# EAGLE design RAMA_M10-A_R1 (EAGLE 7.3.0)
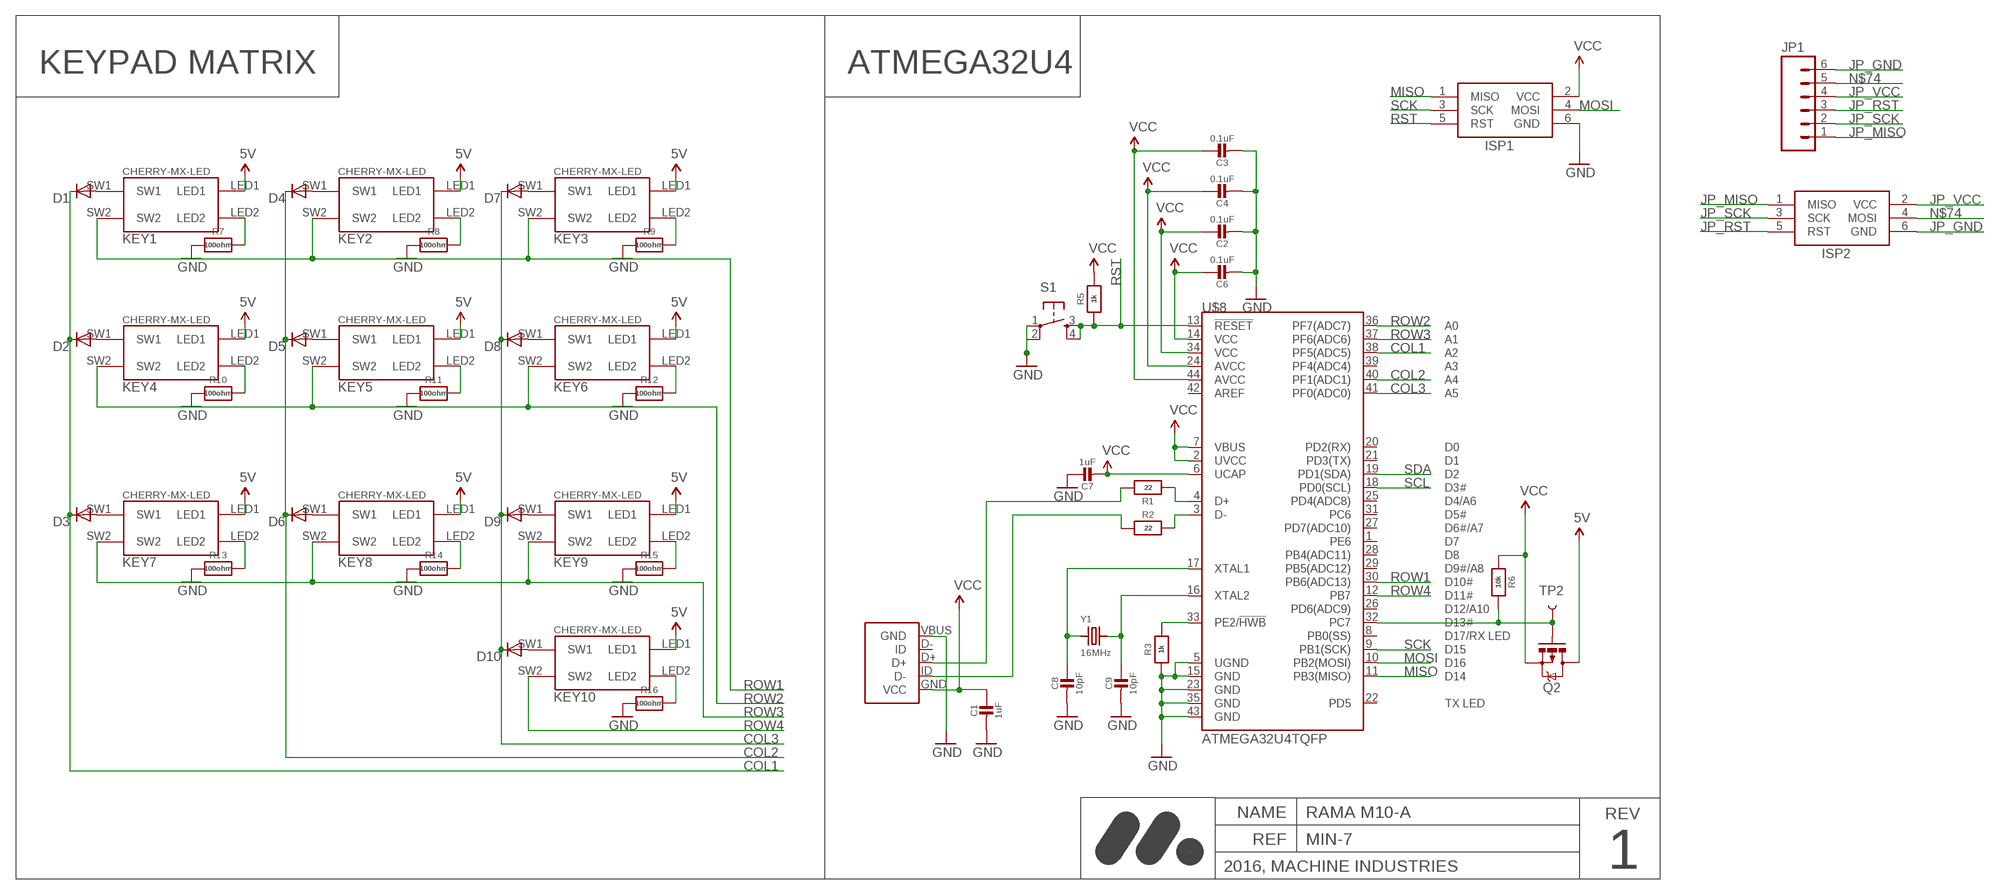
[diagram p0: schematic, sheet 1]

## Parts
C1  1uF  CAP_CERAMIC_0603MP  [_0603MP]
C2  0.1uF  CAP_CERAMIC_0603MP  [_0603MP]
C3  0.1uF  CAP_CERAMIC_0603MP  [_0603MP]
C4  0.1uF  CAP_CERAMIC_0603MP  [_0603MP]
C6  0.1uF  CAP_CERAMIC_0603MP  [_0603MP]
C7  1uF  CAP_CERAMIC_0603MP  [_0603MP]
C8  10pF  CAP_CERAMIC_0603MP  [_0603MP]
C9  10pF  CAP_CERAMIC_0603MP  [_0603MP]
D1  DIODESOD  [SOD-323]
D2  DIODESOD  [SOD-323]
D3  DIODESOD  [SOD-323]
D4  DIODESOD  [SOD-323]
D5  DIODESOD  [SOD-323]
D6  DIODESOD  [SOD-323]
D7  DIODESOD  [SOD-323]
D8  DIODESOD  [SOD-323]
D9  DIODESOD  [SOD-323]
D10  DIODESOD  [SOD-323]
ISP1  AVRISP-SMT  [AVRISP-SMT]
ISP2  AVRISP-SMT  [AVRISP-SMT]
JP1  M06SIP  [1X06]
KEY1  CHERRY-MX-LED-18X18  [CHERRY-MX-LED-18X18]
KEY2  CHERRY-MX-LED-18X18  [CHERRY-MX-LED-18X18]
KEY3  CHERRY-MX-LED-18X18  [CHERRY-MX-LED-18X18]
KEY4  CHERRY-MX-LED-18X18  [CHERRY-MX-LED-18X18]
KEY5  CHERRY-MX-LED-18X18  [CHERRY-MX-LED-18X18]
KEY6  CHERRY-MX-LED-18X18  [CHERRY-MX-LED-18X18]
KEY7  CHERRY-MX-LED-18X18  [CHERRY-MX-LED-18X18]
KEY8  CHERRY-MX-LED-18X18  [CHERRY-MX-LED-18X18]
KEY9  CHERRY-MX-LED-18X18  [CHERRY-MX-LED-18X18]
KEY10  CHERRY-MX-LED-18X18  [CHERRY-MX-LED-18X18]
Q2  PCHANNEL-MOSFET  MOSFET-PCHANNELSMD  [SOT23-3]
R1  22  RESISTOR_0603MP  [_0603MP]
R2  22  RESISTOR_0603MP  [_0603MP]
R3  1k  RESISTOR_0603MP  [_0603MP]
R5  1k  RESISTOR_0603MP  [_0603MP]
R6  10k  RESISTOR_0603MP  [_0603MP]
R7  100ohm  RESISTOR_0603MP  [_0603MP]
R8  100ohm  RESISTOR_0603MP  [_0603MP]
R9  100ohm  RESISTOR_0603MP  [_0603MP]
R10  100ohm  RESISTOR_0603MP  [_0603MP]
R11  100ohm  RESISTOR_0603MP  [_0603MP]
R12  100ohm  RESISTOR_0603MP  [_0603MP]
R13  100ohm  RESISTOR_0603MP  [_0603MP]
R14  100ohm  RESISTOR_0603MP  [_0603MP]
R15  100ohm  RESISTOR_0603MP  [_0603MP]
R16  100ohm  RESISTOR_0603MP  [_0603MP]
S1  TAC_SWITCHSMD  [TACTILE_SWITCH_SMD]
TP2  TEST-POINT3  [PAD.03X.03]
U$8  ATMEGA32U4TQFP  [SPARKFUN-DIGITALIC_TQFP44]
U$9  MICRO-USB-B-FEMALE  [10118192-0001LF]
Y1  16MHz  CRYSTAL3.2X2.5  [CRYSTAL_3.2X2.5]

## Nets
5V: KEY1.LED1 KEY2.LED1 KEY3.LED1 KEY4.LED1 KEY5.LED1 KEY6.LED1 KEY7.LED1 KEY8.LED1 KEY9.LED1 KEY10.LED1 Q2.3(D)
COL1: D1.1(C) D2.1(C) D3.1(C) U$8.38(PF5(ADC5))
COL2: D4.1(C) D5.1(C) D6.1(C) U$8.40(PF1(ADC1))
COL3: D7.1(C) D8.1(C) D9.1(C) D10.1(C) U$8.41(PF0(ADC0))
GND: C1.2 C2.2 C3.2 C4.2 C6.2 C7.1 C8.2 C9.2 ISP1.6(GND) R3.1 R7.1 R8.1 R9.1 R10.1 R11.1 R12.1 R13.1 R14.1 R15.1 R16.1 S1.1 S1.2 U$8.5(UGND) U$8.15(GND) U$8.23(GND) U$8.35(GND) U$8.43(GND) U$9.VBUS(GND)
JP_GND: ISP2.6(GND) JP1.6
JP_MISO: ISP2.1(MISO) JP1.1
JP_RST: ISP2.5(RST) JP1.3
JP_SCK: ISP2.3(SCK) JP1.2
JP_VCC: ISP2.2(VCC) JP1.4
MISO: ISP1.1(MISO) U$8.11(PB3(MISO))
MOSI: ISP1.4(MOSI) U$8.10(PB2(MOSI))
N$6: R1.1 U$9.D+
N$7: R2.1 U$9.ID(D-)
N$8: R2.2 U$8.3(D-)
N$9: R1.2 U$8.4(D+)
N$10: C8.1 U$8.17(XTAL1) Y1.1
N$11: C9.1 U$8.16(XTAL2) Y1.2
N$12: R3.2 U$8.33(PE2/!HWB)
N$13: Q2.1(G) R6.2 TP2.P$1 U$8.32(PC7)
N$16: D1.2(A) KEY1.SW1
N$17: D2.2(A) KEY4.SW1
N$18: D3.2(A) KEY7.SW1
N$19: D4.2(A) KEY2.SW1
N$20: D5.2(A) KEY5.SW1
N$21: D6.2(A) KEY8.SW1
N$22: D9.2(A) KEY9.SW1
N$23: D8.2(A) KEY6.SW1
N$24: D7.2(A) KEY3.SW1
N$25: D10.2(A) KEY10.SW1
N$28: KEY7.LED2 R13.2
N$29: KEY8.LED2 R14.2
N$30: KEY9.LED2 R15.2
N$31: KEY10.LED2 R16.2
N$32: KEY4.LED2 R10.2
N$69: KEY5.LED2 R11.2
N$70: KEY6.LED2 R12.2
N$71: KEY3.LED2 R9.2
N$72: KEY2.LED2 R8.2
N$73: KEY1.LED2 R7.2
N$74: ISP2.4(MOSI) JP1.5
ROW1: KEY1.SW2 KEY2.SW2 KEY3.SW2 U$8.30(PB6(ADC13))
ROW2: KEY4.SW2 KEY5.SW2 KEY6.SW2 U$8.36(PF7(ADC7))
ROW3: KEY7.SW2 KEY8.SW2 KEY9.SW2 U$8.37(PF6(ADC6))
ROW4: KEY10.SW2 U$8.12(PB7)
RST: ISP1.5(RST) R5.1 S1.3 S1.4 U$8.13(!RESET)
SCK: ISP1.3(SCK) U$8.9(PB1(SCK))
SCL: U$8.18(PD0(SCL))
SDA: U$8.19(PD1(SDA))
VCC: C1.1 C2.1 C3.1 C4.1 C6.1 C7.2 ISP1.2(VCC) Q2.2(S) R5.2 R6.1 U$8.2(UVCC) U$8.6(UCAP) U$8.7(VBUS) U$8.14(VCC) U$8.24(AVCC) U$8.34(VCC) U$8.44(AVCC) U$9.GND(VCC)
Unconnected: U$8.1(PE6) U$8.8(PB0(SS)) U$8.20(PD2(RX)) U$8.21(PD3(TX)) U$8.22(PD5) U$8.25(PD4(ADC8)) U$8.26(PD6(ADC9)) U$8.27(PD7(ADC10)) U$8.28(PB4(ADC11)) U$8.29(PB5(ADC12)) U$8.31(PC6) U$8.39(PF4(ADC4)) U$8.42(AREF) U$9.D-(ID)

## Notes on the sheet
- KEYPAD MATRIX | ATMEGA32U4
- NAME | RAMA M10-A | REV
- REF | MIN-7
- 2016, MACHINE INDUSTRIES | 1

## Library data of the parts
C1-C4 C6-C9 = Adafruit Bluefruit LE nRF8001:CAP_CERAMIC: Ceramic Capacitors For new designs, use the packages preceded by an '_' character since they are more reliable: The following footprints should be used on most boards: _0402 - Standard footprint for regular board layouts _0603 - Standard footprint for regular board layouts _0805 - Standard footprint for regular board layouts _1206 - Standard footprint for regular board layouts For extremely tight-pitch boards where space is at a premium, the following 'micro-pitch' footprints can be used (smaller pads, no silkscreen outline, etc.): _0402MP - Micro-pitch footprint for very dense/compact boards _0603MP - Micro-pitch footprint for very dense/compact boards _0805MP - Micro-pitch footprint for very dense/compact boards _1206MP - Micro-pitch footprint for very dense/compact boards
D1-D10 = SparkFun-DiscreteSemi:DIODE: Diode These are standard reverse protection diodes and small signal diodes. SMA package can handle up to about 1A. SOD-323 can handle about 200mA. What the SOD-323 package when ordering, there are some mfgs out there that are 5-pin packages.; PROD_ID: DIO-09646
ISP1 ISP2 = adafruit:AVRISP: AVR ISP HEADER Standard 6 pin header for AVR programming
JP1 = SparkFun-Connectors:M06: Header 6 Standard 6-pin 0.1" header. Use with straight break away headers (SKU : PRT-00116), right angle break away headers (PRT-00553), swiss pins (PRT-00743), machine pins (PRT-00117), and female headers (PRT-00115). Molex polarized connector foot print use with SKU : PRT-08094 with associated crimp pins and housings. NOTES ON THE VARIANTS LOCK and LOCK_LONGPADS... This footprint was designed to help hold the alignment of a through-hole component (i.e. 6-pin header) while soldering it into place. You may notice that each hole has been shifted either up or down by 0.005 of an inch from it's more standard position (which is a perfectly straight line). This slight alteration caused the pins (the squares in the middle) to touch the edges of the holes. Because they are alternating, it causes a "brace" to hold the component in place. 0.005 has proven to be the perfect amount of "off-center" position when using our standard breakaway headers. Although looks a little odd when you look at the bare footprint, once you have a header in there, the alteration is very hard to notice. Also,if you push a header all the way into place, it is covered up entirely on the bottom side. This idea of altering the position of holes to aid alignment will be further integrated into the Sparkfun Library for other footprints. It can help hold any component with 3 or more connection pins.
KEY1-KEY10 = cherrymx:CHERRY-MX-LED: Cherry MX series keyswitch with LED
Q2 = SparkFun-DiscreteSemi:MOSFET-PCHANNEL: Generic PMOSFET
R1-R3 R5-R16 = Adafruit Bluefruit LE nRF8001:RESISTOR: Resistors For new designs, use the packages preceded by an '_' character since they are more reliable: The following footprints should be used on most boards: _0402 - Standard footprint for regular board layouts _0603 - Standard footprint for regular board layouts _0805 - Standard footprint for regular board layouts _1206 - Standard footprint for regular board layouts For extremely tight-pitch boards where space is at a premium, the following 'micro-pitch' footprints can be used (smaller pads, no silkscreen outline, etc.): _0402MP - Micro-pitch footprint for very dense/compact boards _0603MP - Micro-pitch footprint for very dense/compact boards _0805MP - Micro-pitch footprint for very dense/compact boards _1206MP - Micro-pitch footprint for very dense/compact boards
S1 = SparkFun-Electromechanical:TAC_SWITCH: Momentary Switch Button commonly used for reset or general input. Spark Fun Electronics SKU : COM-00097 SMT- SWCH-08247; PROD_ID: SWCH-08247
TP2 = SparkFun-Passives:TEST-POINT: Bare copper test points for troubleshooting or ICT
U$8 = SparkFun-DigitalIC:ATMEGA32U4: Atmel 44-pin 8-bit Microcontroller with 32KBytes of ISP Flash and USB Controller ----- Please use the QFN-44-NOPAD_1:1 package for the footprint of all boards using a 32U4. Route traces directly away from the pads as much as possible.; PROD_ID: IC-11161
U$9 = Bolt:MICRO-USB-B-FEMALE
Y1 = Adafruit Bluefruit LE nRF8001:CRYSTAL: Crystals HC49UP - Surface Mount Crystal 4.0MHz 18pF +/-30ppm Surface Mount Crystal [Digikey: 535-9857-1-ND] 12.0 MHz Surface Mount Crystal [Digikey: 535-9869-6-ND] 25.0 MHz Surface Mount Crystal [Digikey: 535-9078-1-ND] 2.5 x 2.0mm - MEMs SMT Crystal 16.0 MHz 10pF 20ppm 2.5 x 2.0mm Crystal [Digikey -40-85°C: 535-10923-1-ND] 3.2 x 2.5mm - MEMs SMT Crystal 12.0 MHz 8pF 15ppm 3.2 x 2.5mm Crystal [Digikey: -10-70°C: 644-1047-1-ND -40-125°C: 644-1128-1-ND] 40~85°C cheaper: 644-1173-6-ND 16.0 MHz 8pF 15ppm 3.2 x 2.5mm Crystal [Digikey: -10-70°C: 644-1049-1-ND -40-125°C: 644-1129-2-ND]-40~85°C cheaper: 644-1175-6-ND 16.0 MHz 10pF 10ppm 3.2 x 2.5mm Crystal [Digikey: 644-1100-1-ND] 27.12 MHz 18pF 30ppm 3.2 x 2.5mm Crystal [Digikey: 887-1424-1-ND] 27.12MHz 10pF 10ppm 3.2 x 2.5mm Crystal [Digikey: 887-1329-1-ND] 4.9 x 1.8mm - MEMs SMT Crystal 32.768 KHz 12.5pF 20ppm 4.9 x 1.8mm Crystal [Digikey: SE2415CT-ND] 8.0 x 3.8mm - Surface Mount Crystal 32.768kHz 12.5pF 20ppm -40°C-85°C [Digikey: 535-9166-2-ND] Cylinder 32.768KHz Cylinder Crystal (2x6mm body) [Ex. Digikey: 300-8341-2-ND]

## Board
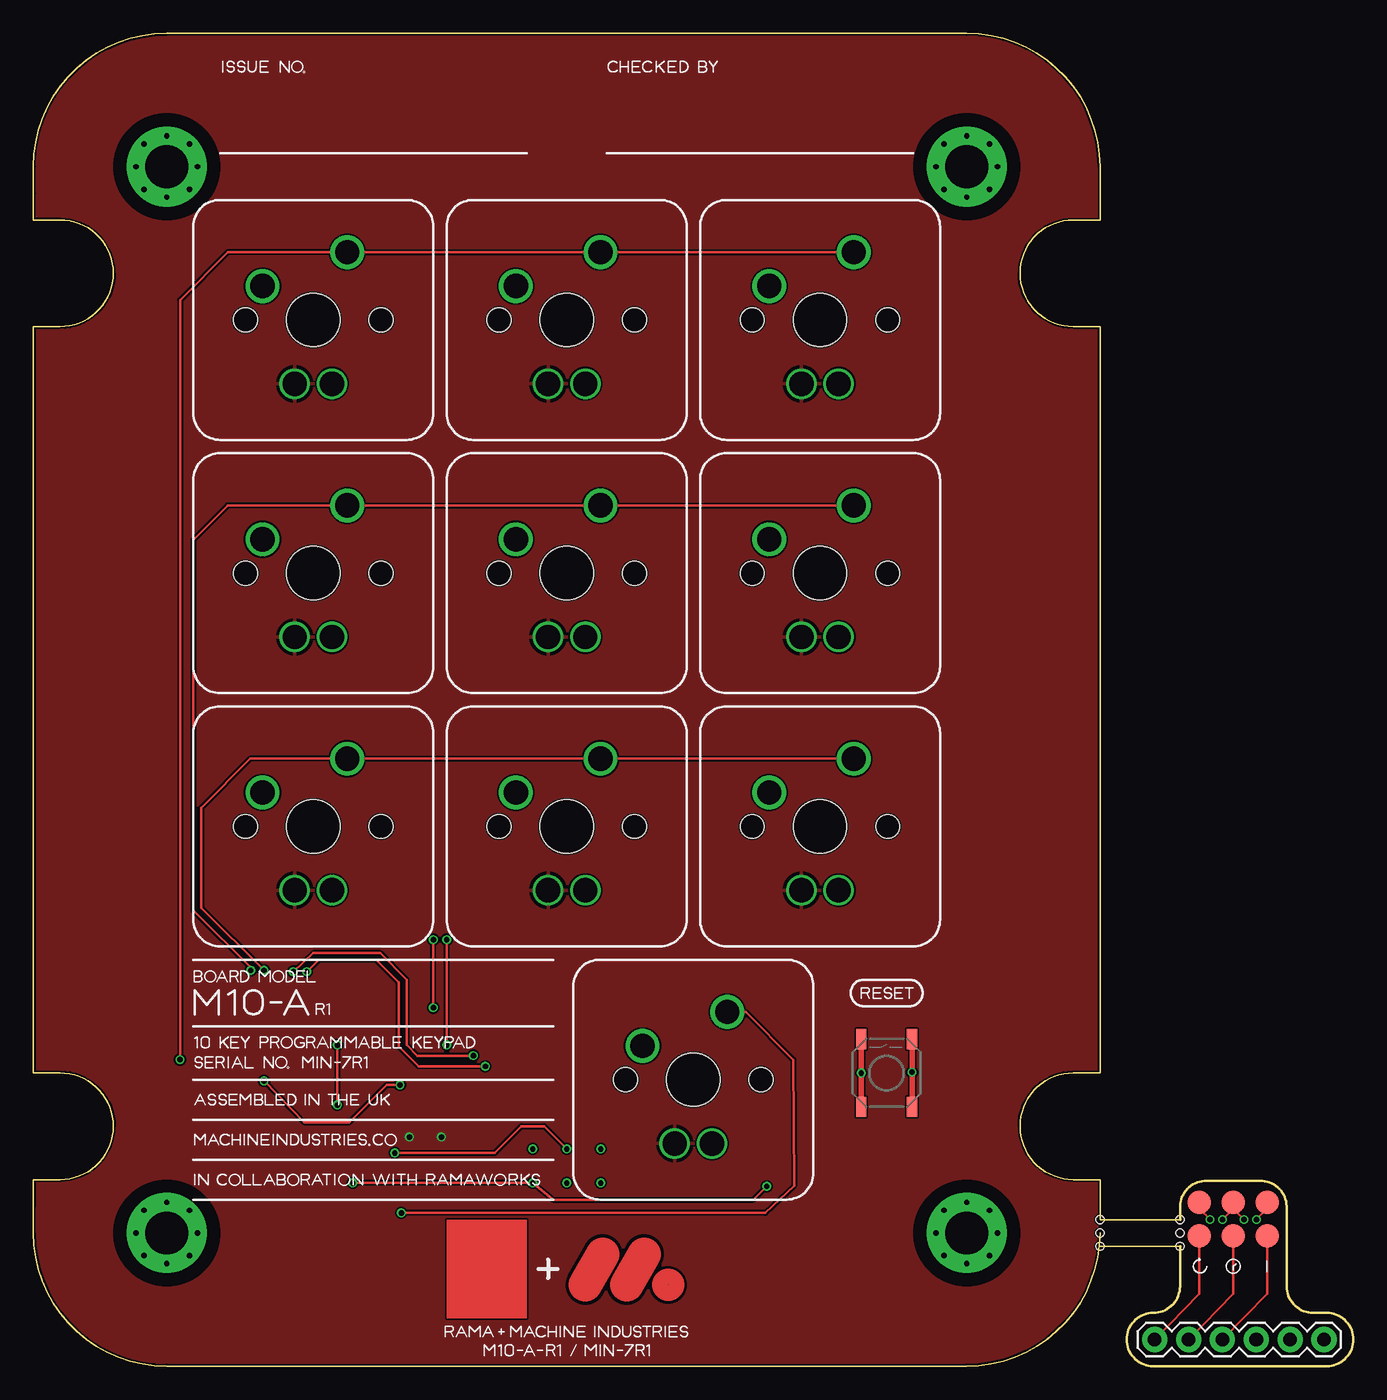
[diagram p1: board, top side]
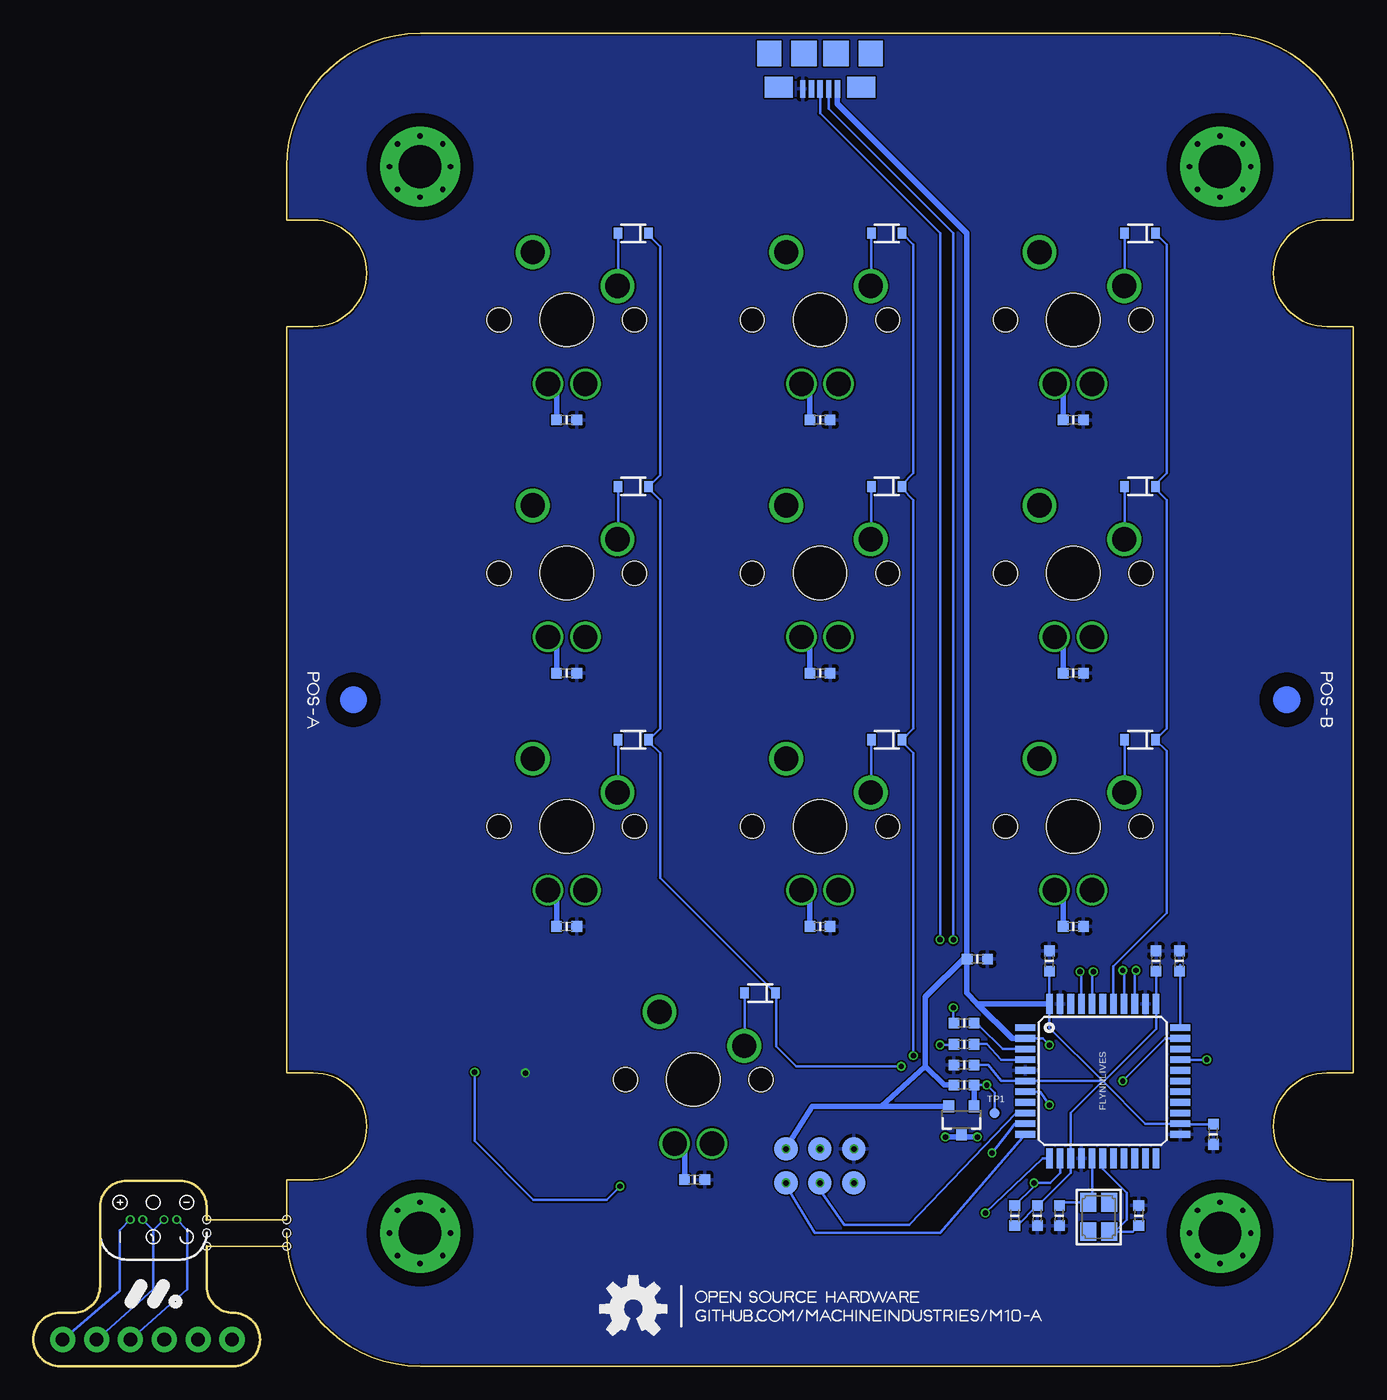
[diagram p2: board, bottom side, seen from below]

Size 99 x 100 mm. Coordinates in mm from the lower left corner, seen from the top.
Outline: 80,10 arc-90 70,0 10,0 arc-90 0,10 0,12 0,14 2,14 arc90 6,18 arc90 2,22 0,22 0,78 2,78 arc90 6,82 arc90 2,86 0,86 0,88 0,90 arc-90 10,100 70,100 arc-90 80,90 80,86 78,86 arc90 74,82 arc90 78,78 80,78 80,22 78,22 arc90 74,18 arc90 78,14 80,14 80,11 86,11 86,12 arc-90 88,13.9 92,13.9 arc-90 94,12 94,6 arc90 96,4 97,4 arc-90 99,2 arc-90 97,0 84,0 arc-90 82,2 arc-90 84,4 arc90 86,6 86,9 80,9
Copper layers (1*16): Top 0.035mm / dielectric 1.5mm / Bottom 0.035mm
Design rules "default *": minimum track width 1.25mm, minimum drill 12mil, track to track 0.125mm, track to pad 0.125mm, pad to pad 0.125mm, via to via 0.125mm, smd to smd 0mil, copper to edge 0.125mm, drill to drill 0.125mm, minimum pad ring 5mil, minimum via ring 5mil, stop-mask expansion 4mil, vias tented up to drill 0.4mm, thermal gap 10mil
Holes 0.6 mm at 86,11 86,10 86,9 80,11 80,10 80,9
tRestrict: area 8,8 to 12,12; area 46.9,5.4 to 48.3,6.8; area 31,3.6 to 37,11; area 8,88 to 12,92; area 68,88 to 72,92; area 68,8 to 72,12; 2 lines
bRestrict: area 3,48 to 7,52; area 8,8 to 12,12; area 73,48 to 77,52; area 8,88 to 12,92; area 68,88 to 72,92; area 68,8 to 72,12

### Footprints (pad centres in the part's own frame; a part is rotated, then mirrored left to right if it is on the bottom)
_0603MP = smd 0.8 x 0.8: 1 -0.762,0; 2 0.762,0
SOD-323 = smd 0.63 x 0.83: 1 -1.15,0; 2 1.15,0
AVRISP-SMT = smd 1.778 x 1.778: 1 -1.23,2.55; 2 1.31,2.55; 3 -1.23,0.01; 4 1.31,0.01; 5 -1.23,-2.53; 6 1.31,-2.53
1X06 = drill 1.016 pad 1.88: 1 0,0; 2 2.54,0; 3 5.08,0; 4 7.62,0; 5 10.16,0; 6 12.7,0
CHERRY-MX-LED-18X18 = drill 1.82 pad 2.286: LED1 -1.397,-4.791; LED2 1.397,-4.791 | drill 1.82 pad 2.54: SW1 -3.81,2.54; SW2 2.54,5.08 | hole 4: 0,0 | hole 1.8: 5.08,0; -5.08,0
SOT23-3 = smd 0.8 x 0.9: 1 -0.95,-1; 2 0.95,-1; 3 0,1.1
TACTILE_SWITCH_SMD = smd 1.524 x 0.762: 1 -2.54,1.905; 2 2.54,1.905; 3 -2.54,-1.905; 4 2.54,-1.905
PAD.03X.03 = smd 0.762 x 0.762: P$1 0,0
SPARKFUN-DIGITALIC_TQFP44 = smd 1.5 x 0.5: 1 -5.8,4; 2 -5.8,3.2; 3 -5.8,2.4; 4 -5.8,1.6; 5 -5.8,0.8; 6 -5.8,0; 7 -5.8,-0.8; 8 -5.8,-1.6; 9 -5.8,-2.4; 10 -5.8,-3.2; 11 -5.8,-4; 23 5.8,-4; 24 5.8,-3.2; 25 5.8,-2.4; 26 5.8,-1.6; 27 5.8,-0.8; 28 5.8,0; 29 5.8,0.8; 30 5.8,1.6; 31 5.8,2.4; 32 5.8,3.2; 33 5.8,4 | smd 0.5 x 1.5: 12 -4,-5.8; 13 -3.2,-5.8; 14 -2.4,-5.8; 15 -1.6,-5.8; 16 -0.8,-5.8; 17 0,-5.8; 18 0.8,-5.8; 19 1.6,-5.8; 20 2.4,-5.8; 21 3.2,-5.8; 22 4,-5.8; 34 4,5.8; 35 3.2,5.8; 36 2.4,5.8; 37 1.6,5.8; 38 0.8,5.8; 39 0,5.8; 40 -0.8,5.8; 41 -1.6,5.8; 42 -2.4,5.8; 43 -3.2,5.8; 44 -4,5.8
10118192-0001LF = smd 0.4 x 1.35: D+ 0,2.675; D- 0.65,2.675; GND -1.3,2.675; GND1 -1.3,2.675; ID -0.65,2.675; VBUS 1.3,2.675 | smd 2.1 x 1.6: P$6 -3.1,2.55; P$7 3.1,2.55 | smd 1.8 x 1.9: P$8 -3.8,0; P$9 3.8,0 | smd 1.9 x 1.9: P$10 -1.2,0; P$11 1.2,0
CRYSTAL_3.2X2.5 = smd 1.4 x 1.2: 1 -1.1,-0.8; 2 1.1,0.8; GND1 -1.1,0.8; GND2 1.1,-0.8

### Placement (x,y rotation side)
C1  28.2,30.55 0 bottom
C2  10.5,17.4 270 bottom
C3  22.8,30.4 90 bottom
C4  23.7,11.3 270 bottom
C6  14.8,30.4 90 bottom
C7  29.2,22.6 0 bottom
C8  16.1,11.3 90 bottom
C9  22.05,11.3 270 bottom
D1  16,85 180 bottom
D2  16,66 180 bottom
D3  16,47 180 bottom
D4  35,85 180 bottom
D5  35,66 180 bottom
D6  35,47 180 bottom
D7  54,85 180 bottom
D8  54,66 180 bottom
D9  54,47 180 bottom
D10  44.5,28 180 bottom
ISP1  40,15 90 bottom
ISP2  90,11 90 top
JP1  84.1,2 0 top
KEY1  21,78.5 0 top
KEY2  40,78.5 0 top
KEY3  59,78.5 0 top
KEY4  21,59.5 0 top
KEY5  40,59.5 0 top
KEY6  59,59.5 0 top
KEY7  21,40.5 0 top
KEY8  40,40.5 0 top
KEY9  59,40.5 0 top
KEY10  49.5,21.5 0 top
Q2  29.4,18.5 180 bottom
R1  29.2,24.15 0 bottom
R2  29.2,25.75 0 bottom
R3  13.05,30.4 270 bottom
R5  25.4,11.3 270 bottom
R6  29.2,21.1 0 bottom
R7  21,71 180 bottom
R8  40,71 180 bottom
R9  59,71 180 bottom
R10  21,52 180 bottom
R11  40,52 180 bottom
R12  59,52 180 bottom
R13  21,33 180 bottom
R14  40,33 180 bottom
R15  59,33 180 bottom
R16  49.4,14 180 bottom
S1  64,22 90 top
TP2  26.9,19 0 bottom
U$8  18.8,21.4 0 bottom
U$9  40,98.5 180 bottom
Y1  19.1,11.2 90 bottom

### Tracks (layer width: path | path; a pad name or v marks a point on that pad's centre or on a via)
5V  (via drill 0.4)
  Bottom 0.4: 29.3,17.4 Q2.3 29,17.2 v28.2,17.2 | v30.6,17.2 29.3,17.2
  pour Top: -1,101 81,101 81,-1 -1,-1
COL1
  Bottom 0.2: D1.1 14,84.15 14,67 14.85,66.15 D2.1 14.85,65.85 14,65 14,47.85 D3.1 14,46.15 14,34 18,30 U$8.38
COL2  (via drill 0.4)
  Top 0.2: v33,23.3 28.8,23.3 28,24.1 28,29 26,31 21,31 v19.5,29.6
  Bottom 0.2: D4.1 33,84.15 33,67 33.85,66.15 D5.1 33.85,65.85 33,65 33,47.85 D6.1 33.85,46.85 33,46 v33,23.3 | U$8.40 19.6,29.5 v19.5,29.6
COL3  (via drill 0.4)
  Top 0.2: v33.9,22.5 28.9,22.5 27.4,24 27.4,28.8 25.7,30.5 21.4,30.5 v20.5,29.6
  Bottom 0.2: D7.1 52.85,84.85 52,84 52,66.85 D8.1 52.85,65.85 52,65 52,47.85 D9.1 52.85,46.85 52,46 52,36.65 D10.1 | D10.1 43.3,28 | U$8.41 20.4,29.5 v20.5,29.6 | v33.9,22.5 41.8,22.5 43.3,24 43.3,27.95 D10.1
GND  (via drill 0.4)
  Top 0.4: S1.1 62.09,21.89 v62.1,22 S1.2
  other vias: 37.45,16.3
  pour Bottom: -2,-2 82,-2 82,102 -2,102
JP_GND  (via drill 0.4)
  Top 0.2: v91.73,11.01 92.72,12 93,12 92.69,12.31 ISP2.6
  Bottom 0.2: JP1.6 92.53,5.67 92.53,10.21 v91.73,11.01
JP_MISO
  Top 0.2: JP1.1 87.45,5.45 ISP2.1
JP_RST
  Top 0.2: JP1.3 92.53,5.45 ISP2.5
JP_SCK
  Top 0.2: JP1.2 89.99,5.45 ISP2.3
JP_VCC  (via drill 0.4)
  Top 0.2: 87.76,12 88,12 87.69,12.31 ISP2.2 87.45,11.81 v88.25,11.01
  Bottom 0.2: JP1.4 87.45,5.77 87.45,10.21 v88.25,11.01
MISO  (via drill 0.4)
  Bottom 0.2: 42.6,13.72 ISP1.1 v42.55,13.75 42.55,13.55 40.4,10 31,10 U$8.11
MOSI  (via drill 0.4)
  Top 0.2: v27.1,16 34.6,16 36.6,18 38.3,18 v39.99,16.31 ISP1.4 v40,16.3
  Bottom 0.2: ISP1.4 v40.01,16.29 v40,16.3 | U$8.10 25.4,18.2 26,17.4 v27.1,16
N$6  (via drill 0.4)
  Top 0.2: v31,24.1 v31,32
  Bottom 0.2: U$9.D+ 40,94 31,85 v31,32 | R1.1 29.95,24.05 30.4,24.1 v31,24.1
N$7  (via drill 0.4)
  Top 0.2: v30,26.9 v30,32
  Bottom 0.2: U$9.ID 39.35,94.35 30,85 v30,32 | R2.1 30,25.59 v30,26.9
N$8
  Bottom 0.2: U$8.3 26.3,23.8 28.05,25.55 R2.2
N$9
  Bottom 0.2: U$8.4 26.4,23 27.5,24.2 28.39,24.2 R1.2
N$10
  Bottom 0.2: U$8.17 18.8,14.8 17,13 17,11 17.9,10.1 Y1.1 16.54,10.1 C8.1
N$11
  Bottom 0.2: C9.1 21.81,12.3 Y1.2 19.6,12.6 U$8.16
N$12
  Bottom 0.2: R3.2 13,30.09 U$8.33
N$13  (via drill 0.4)
  Top 0.2: v17.3,21.4 20.3,18.3 23.7,18.3 26.5,21.1 v27.5,21.1
  Bottom 0.2: U$8.32 14.1,24.6 v17.3,21.4 | R6.2 v27.5,21.1 26.9,20.5 TP2.P$1
  Bottom 0.4: Q2.1 28.45,21.09 R6.2
N$16
  Bottom 0.2: KEY1.SW1 17.15,81.08 D1.2
N$17
  Bottom 0.2: KEY4.SW1 17.15,62.08 D2.2
N$18
  Bottom 0.2: KEY7.SW1 17.15,43.08 D3.2
N$19
  Bottom 0.2: KEY2.SW1 36.15,81.08 D4.2
N$20
  Bottom 0.2: KEY5.SW1 36.15,62.08 D5.2
N$21
  Bottom 0.2: KEY8.SW1 36.15,43.08 D6.2
N$22
  Bottom 0.2: KEY9.SW1 55.15,43.08 D9.2
N$23
  Bottom 0.2: KEY6.SW1 55.15,62.08 D8.2
N$24
  Bottom 0.2: KEY3.SW1 55.15,81.08 D7.2
N$25
  Bottom 0.2: KEY10.SW1 45.65,24.08 D10.2
N$26
  Top 2.5: 41.4,6.1 42.7,8.4
N$27
  Top 2.5: 44.5,6.1 45.8,8.4
N$28
  Bottom 0.4: R13.2 21.76,35.07 KEY7.LED2
N$29
  Bottom 0.4: R14.2 40.76,35.07 KEY8.LED2
N$30
  Bottom 0.4: R15.2 59.76,35.07 KEY9.LED2
N$31
  Bottom 0.4: R16.2 50.16,16.17 KEY10.LED2
N$32
  Bottom 0.4: R10.2 21.76,54.07 KEY4.LED2
N$33  (via drill 3.2 pad 6)
  other vias: 10,10
N$34  (via drill 3.2 pad 6)
  other vias: 10,90
N$35  (via drill 3.2 pad 6)
  other vias: 70,90
N$36  (via drill 3.2 pad 6)
  other vias: 70,10
N$37  (via drill 0.4)
  other vias: 10,12.3
N$38  (via drill 0.4)
  other vias: 12.3,10
N$39  (via drill 0.4)
  other vias: 7.7,10
N$40  (via drill 0.4)
  other vias: 10,7.7
N$41  (via drill 0.4)
  other vias: 8.3,11.7
N$42  (via drill 0.4)
  other vias: 11.7,8.3
N$43  (via drill 0.4)
  other vias: 8.3,8.3
N$44  (via drill 0.4)
  other vias: 11.7,11.7
N$45  (via drill 0.4)
  other vias: 10,92.3
N$46  (via drill 0.4)
  other vias: 12.3,90
N$47  (via drill 0.4)
  other vias: 7.7,90
N$48  (via drill 0.4)
  other vias: 10,87.7
N$49  (via drill 0.4)
  other vias: 8.3,91.7
N$50  (via drill 0.4)
  other vias: 11.7,88.3
N$51  (via drill 0.4)
  other vias: 8.3,88.3
N$52  (via drill 0.4)
  other vias: 11.7,91.7
N$53  (via drill 0.4)
  other vias: 70,92.3
N$54  (via drill 0.4)
  other vias: 72.3,90
N$55  (via drill 0.4)
  other vias: 67.7,90
N$56  (via drill 0.4)
  other vias: 70,87.7
N$57  (via drill 0.4)
  other vias: 68.3,91.7
N$58  (via drill 0.4)
  other vias: 71.7,88.3
N$59  (via drill 0.4)
  other vias: 68.3,88.3
N$60  (via drill 0.4)
  other vias: 71.7,91.7
N$61  (via drill 0.4)
  other vias: 70,12.3
N$62  (via drill 0.4)
  other vias: 72.3,10
N$63  (via drill 0.4)
  other vias: 67.7,10
N$64  (via drill 0.4)
  other vias: 70,7.7
N$65  (via drill 0.4)
  other vias: 68.3,11.7
N$66  (via drill 0.4)
  other vias: 71.7,8.3
N$67  (via drill 0.4)
  other vias: 68.3,8.3
N$68  (via drill 0.4)
  other vias: 71.7,11.7
N$69
  Bottom 0.4: R11.2 40.76,54.07 KEY5.LED2
N$70
  Bottom 0.4: R12.2 59.76,54.07 KEY6.LED2
N$71
  Bottom 0.4: R9.2 59.76,73.07 KEY3.LED2
N$72
  Bottom 0.4: R8.2 40.76,73.07 KEY2.LED2
N$73
  Bottom 0.4: R7.2 21.76,73.07 KEY1.LED2
N$74  (via drill 0.4)
  Top 0.2: 90,11.8 ISP2.4 89.99,11.81 v89.19,11.01 | 90,11.8 89.99,12.01 | v90.8,11 90,11.8
  Bottom 0.2: 90,10.2 v90.8,11 | JP1.5 89.99,5.77 89.99,10.21 v89.19,11.01
ROW1  (via drill 0.4)
  Top 0.2: KEY3.SW2 KEY2.SW2 KEY1.SW2 14.58,83.58 11,80 v11,23
  Bottom 0.2: U$8.30 v11,23
ROW2  (via drill 0.4)
  Top 0.2: KEY6.SW2 KEY5.SW2 KEY4.SW2 14.58,64.58 12,62 12,34.2 16.4,29.8 v16.3,29.7
  Bottom 0.2: v16.3,29.7 16.4,29.6 U$8.36
ROW3  (via drill 0.4)
  Top 0.2: KEY9.SW2 KEY8.SW2 KEY7.SW2 16.28,45.58 12.6,41.9 12.6,34.4 v17.3,29.7
  Bottom 0.2: v17.3,29.7 17.2,29.6 U$8.37
ROW4  (via drill 0.4)
  Top 0.2: KEY10.SW2 53.42,26.58 57,23 57.05,13.55 54.9,11.5 v27.6,11.5
  Bottom 0.2: U$8.12 23.3,15.6 v27.6,11.5
RST  (via drill 0.4)
  Top 0.2: v23.95,13.75 v37.45,13.75 39,12.5 54,12.5 v55,13.5
  Top 0.4: v65.9,22.05 S1.3 S1.4
  Bottom 0.2: U$8.13 22,14.5 22.75,13.75 v23.95,13.75 23.95,13.51 R5.1 | v65.9,22.05 65.9,16.9 61.5,12.5 56,12.5 v55,13.5 | v37.45,13.75 37.03,13.77 ISP1.5 v37.45,13.75 | 37.05,13.75 v37.45,13.75
SCK  (via drill 0.4)
  Bottom 0.2: U$8.9 25.3,19 33.3,10.6 38.2,10.6 40,13.2 v40,13.75 | v40,13.75 v40,13.76 ISP1.3 v40,13.75
VCC  (via drill 0.4)
  Top 0.2: v22.8,24.1 v22.8,19.6
  Bottom 0.2: U$8.2 23.3,24.6 v22.8,24.1 | 29,30.8 29.01,30 29.01,30.41 | C1.1 29.01,30.5 29.01,30 | U$8.7 23.5,20.6 v22.8,19.6 | C6.1 U$8.34 14.8,25.3 18.7,21.4 18.8,21.4 | C3.1 U$8.44 22.8,25.4 18.8,21.4 | C2.1 12.96,18.16 U$8.24 15.6,18.2 18.8,21.4 | 18.8,21.4 21.2,19 U$8.14 21.2,14.5 23.64,12.06 C4.1 25.22,10.54 R5.2 | C7.2 27.4,22.6 26.4,21.4 U$8.6 18.8,21.4 | ISP1.2 v42.55,16.3 42.6,16.3
  Bottom 0.4: U$9.GND 38.7,94.7 29,85 29,30.8 | 29,30.8 32.1,27.7 32.1,22.5 | 29.01,30 | 29.01,30.41 28.96,30.46 | 29,30.8 29,28 28.2,27.2 | 28.2,27.2 25.6,24.6 U$8.2 | U$8.44 28.2,27.2 | 35.4,19.5 40.6,19.5 42.6,16.3 | 32.1,22.5 35.4,19.5 | 32.1,22.5 30.7,21.1 R6.1 | 35.4,19.5 Q2.2
(copper drawn outside any net)
  shapes: Bottom circle x2, Top area x1, Top circle x1

### Text on the board
bNames: FLYNNLIVES | TP1